# Altium schematic sheet 中继板子.SchDoc
size A3
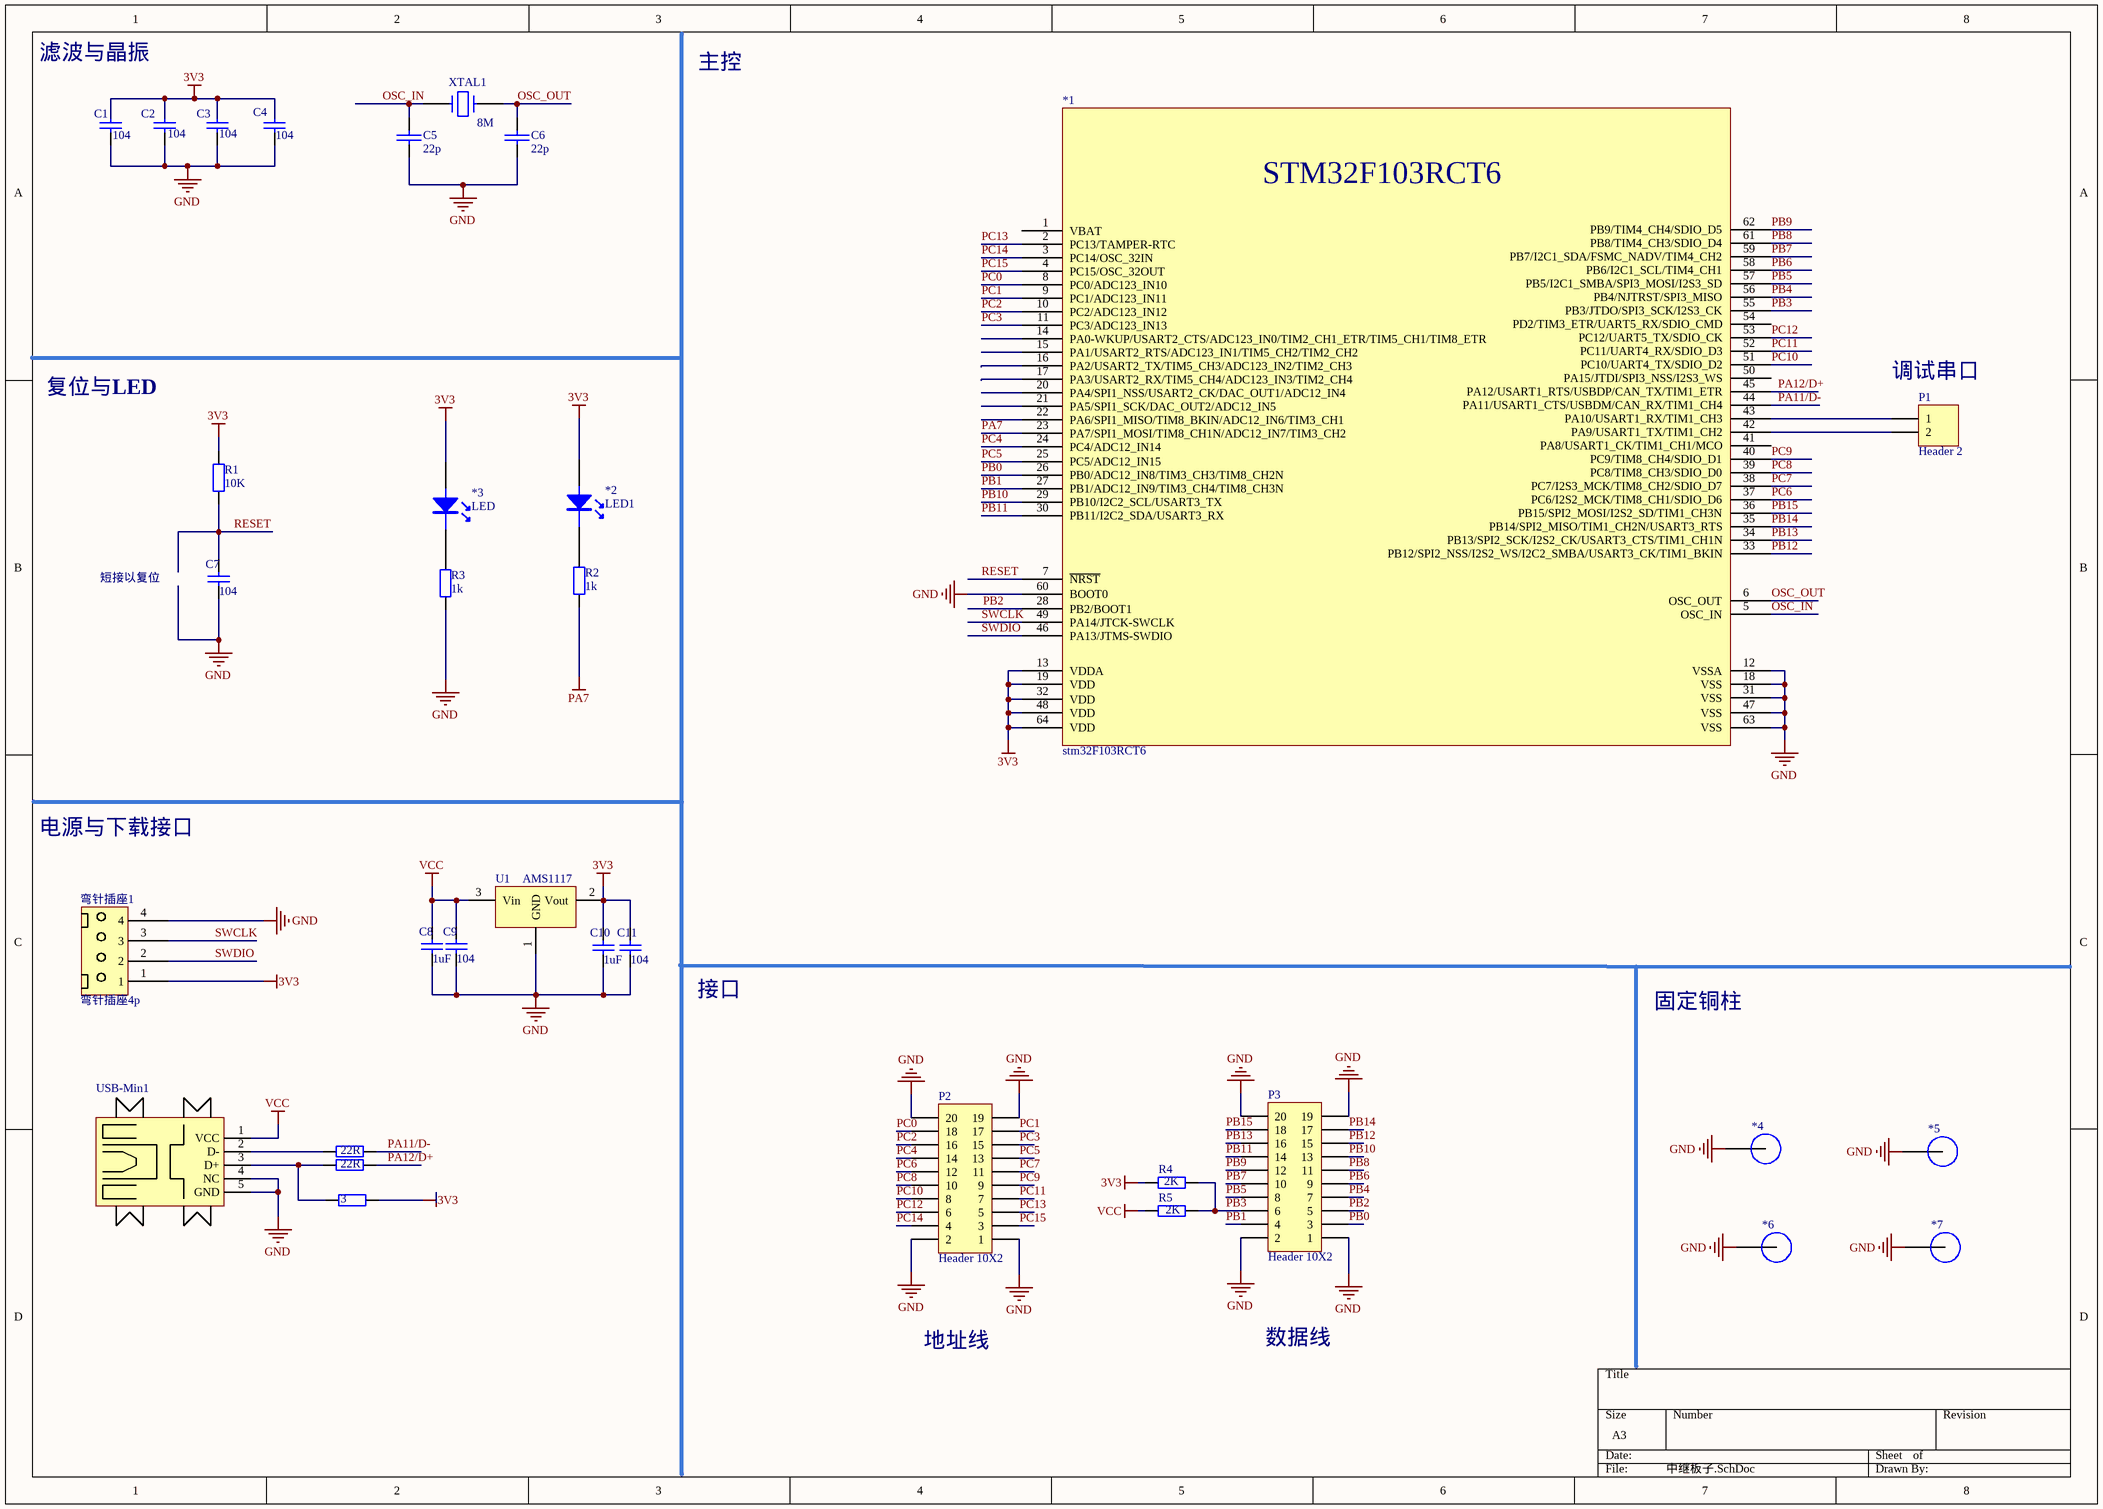
[diagram p0: 中继板子.SchDoc]

## Parts
1  22R  [R 0603]
2  22R  [R 0603]
3  Res  [R 0603]  (value not drawn)
*1  stm32F103RCT6  [LQF64]
*2  LED1  [LED 0805B]
*3  LED  [LED 0805B]
*4  定位孔  [定位孔]  (value not drawn)
*5  定位孔  [定位孔]  (value not drawn)
*6  定位孔  [定位孔]  (value not drawn)
*7  定位孔  [定位孔]  (value not drawn)
C1  104  [R 0603]
C2  104  [R 0603]
C3  104  [R 0603]
C4  104  [R 0603]
C5  22p  [R 0603]
C6  22p  [R 0603]
C7  value 104  [R 0603]  (hidden comment: Cap)
C8  value 1uF  [R 0603]  (hidden comment: Cap)
C9  value 104  [R 0603]  (hidden comment: Cap)
C10  value 1uF  [R 0603]  (hidden comment: Cap)
C11  value 104  [R 0603]  (hidden comment: Cap)
P1  Header 2  [HDR-1x2]
P2  Header 10X2  [HDR-10X2_H]
P3  Header 10X2  [HDR-10X2_H]
R1  value 10K  [R 0603]  (hidden comment: Res2)
R2  1k  [R 0603]
R3  1k  [R 0603]
R4  value 2K  [R 0603]  (hidden comment: Res2)
R5  value 2K  [R 0603]  (hidden comment: Res2)
U1  AMS1117  [AMS1117]
USB-Min1  USB-Mini  [USB-A/S_A]  (value not drawn)
XTAL1  8M  [XTAL-49S DIP]
弯针插座1  弯针插座4p  [XH2.54-4P]

## Nets
3V3: 3.1 *1.13(VDDA) *1.19(VDD) *1.32(VDD) *1.48(VDD) *1.64(VDD) *2.1 *3.1 C1.2 C2.2 C3.2 C4.2 C10.2 C11.2 R1.1 R4.2 U1.2(Vout) 弯针插座1.1
GND: *1.12(VSSA) *1.18(VSS) *1.31(VSS) *1.47(VSS) *1.60(BOOT0) *1.63(VSS) *4.1 *5.1 *6.1 *7.1 C1.1 C2.1 C3.1 C4.1 C5.2 C6.2 C7.1 C8.1 C9.1 C10.1 C11.1 P2.1 P2.2 P2.19 P2.20 P3.1 P3.2 P3.19 P3.20 R3.2 U1.1(GND) USB-Min1.4(NC) USB-Min1.5(GND) 弯针插座1.4
PA7: *1.23(PA7/SPI1_MOSI/TIM8_CH1N/ADC12_IN7/TIM3_CH2) R2.2
VCC: C8.2 C9.2 R5.2 U1.3(Vin) USB-Min1.1(VCC)
OSC_IN: *1.5(OSC_IN) C5.1 XTAL1.2
OSC_OUT: *1.6(OSC_OUT) C6.1 XTAL1.1
PA11/D-: 1.2 *1.44(PA11/USART1_CTS/USBDM/CAN_RX/TIM1_CH4)
PA12/D+: 2.2 *1.45(PA12/USART1_RTS/USBDP/CAN_TX/TIM1_ETR)
PB0: *1.26(PB0/ADC12_IN8/TIM3_CH3/TIM8_CH2N) P3.3
PB1: *1.27(PB1/ADC12_IN9/TIM3_CH4/TIM8_CH3N) P3.4
PB2: *1.28(PB2/BOOT1) P3.5
PB3: *1.55(PB3/JTDO/SPI3_SCK/I2S3_CK) P3.6 R4.1 R5.1
PB4: *1.56(PB4/NJTRST/SPI3_MISO) P3.7
PB5: *1.57(PB5/I2C1_SMBA/SPI3_MOSI/I2S3_SD) P3.8
PB6: *1.58(PB6/I2C1_SCL/TIM4_CH1) P3.9
PB7: *1.59(PB7/I2C1_SDA/FSMC_NADV/TIM4_CH2) P3.10
PB8: *1.61(PB8/TIM4_CH3/SDIO_D4) P3.11
PB9: *1.62(PB9/TIM4_CH4/SDIO_D5) P3.12
PB10: *1.29(PB10/I2C2_SCL/USART3_TX) P3.13
PB11: *1.30(PB11/I2C2_SDA/USART3_RX) P3.14
PB12: *1.33(PB12/SPI2_NSS/I2S2_WS/I2C2_SMBA/USART3_CK/TIM1_BKIN) P3.15
PB13: *1.34(PB13/SPI2_SCK/I2S2_CK/USART3_CTS/TIM1_CH1N) P3.16
PB14: *1.35(PB14/SPI2_MISO/TIM1_CH2N/USART3_RTS) P3.17
PB15: *1.36(PB15/SPI2_MOSI/I2S2_SD/TIM1_CH3N) P3.18
PC0: *1.8(PC0/ADC123_IN10) P2.18
PC1: *1.9(PC1/ADC123_IN11) P2.17
PC2: *1.10(PC2/ADC123_IN12) P2.16
PC3: *1.11(PC3/ADC123_IN13) P2.15
PC4: *1.24(PC4/ADC12_IN14) P2.14
PC5: *1.25(PC5/ADC12_IN15) P2.13
PC6: *1.37(PC6/I2S2_MCK/TIM8_CH1/SDIO_D6) P2.12
PC7: *1.38(PC7/I2S3_MCK/TIM8_CH2/SDIO_D7) P2.11
PC8: *1.39(PC8/TIM8_CH3/SDIO_D0) P2.10
PC9: *1.40(PC9/TIM8_CH4/SDIO_D1) P2.9
PC10: *1.51(PC10/UART4_TX/SDIO_D2) P2.8
PC11: *1.52(PC11/UART4_RX/SDIO_D3) P2.7
PC12: *1.53(PC12/UART5_TX/SDIO_CK) P2.6
PC13: *1.2(PC13/TAMPER-RTC) P2.5
PC14: *1.3(PC14/OSC_32IN) P2.4
PC15: *1.4(PC15/OSC_32OUT) P2.3
RESET: *1.7(~{NRST}) C7.2 R1.2
SWCLK: *1.49(PA14/JTCK-SWCLK) 弯针插座1.3
SWDIO: *1.46(PA13/JTMS-SWDIO) 弯针插座1.2
Net1_1: 1.1 USB-Min1.2(D-)
Net2_1: 2.1 3.2 USB-Min1.3(D+)
Net*1_42: *1.42(PA9/USART1_TX/TIM1_CH2) P1.2
Net*1_43: *1.43(PA10/USART1_RX/TIM1_CH3) P1.1
Net*2_2: *2.2 R2.1
Net*3_2: *3.2 R3.1

Not connected (* = marked no-connect by the designer): *1 1(VBAT) 14(PA0-WKUP/USART2_CTS/ADC123_IN0/TIM2_CH1_ETR/TIM5_CH1/TIM8_ETR) 15(PA1/USART2_RTS/ADC123_IN1/TIM5_CH2/TIM2_CH2) 16(PA2/USART2_TX/TIM5_CH3/ADC123_IN2/TIM2_CH3) 17(PA3/USART2_RX/TIM5_CH4/ADC123_IN3/TIM2_CH4) 20(PA4/SPI1_NSS/USART2_CK/DAC_OUT1/ADC12_IN4) 21(PA5/SPI1_SCK/DAC_OUT2/ADC12_IN5) 22(PA6/SPI1_MISO/TIM8_BKIN/ADC12_IN6/TIM3_CH1) 41(PA8/USART1_CK/TIM1_CH1/MCO) 50(PA15/JTDI/SPI3_NSS/I2S3_WS) 54(PD2/TIM3_ETR/UART5_RX/SDIO_CMD)

## Notes on the sheet
- (near C1) 滤波与晶振
- 主控
- (near P1) 调试串口
- 复位与LED
- 短接以复位
- 电源与下载接口
- 接口
- 固定铜柱
- 地址线
- 数据线
- (in symbol stm32F103RCT6) STM32F103RCT6

## Library data of the parts
1 2 R2 R3 = Res
*2 = LED
C1-C4 = Cap
C5 C6 = CAP
C7-C11 = Cap: Capacitor; Published: 8-Jun-2000; LatestRevisionDate: 17-Jul-2002; LatestRevisionNote: Re-released for DXP Platform.; PackageReference: RAD-0.3; Publisher: Altium Limited; PackageDescription: Radial Cap, Thru-Hole; 2 Leads; 0.3 in Pin Spacing
P1 = Header 2: Header, 2-Pin; LatestRevisionDate: 17-Jul-2002; LatestRevisionNote: Re-released for DXP Platform.; Publisher: Altium Limited
P2 P3 = Header 10X2: Header, 10-Pin, Dual row; LatestRevisionDate: 17-Jul-2002; LatestRevisionNote: Re-released for DXP Platform.; Publisher: Altium Limited
R1 R4 R5 = Res2: Resistor; Published: 8-Jun-2000; LatestRevisionDate: 17-Jul-2002; LatestRevisionNote: Re-released for DXP Platform.; PackageReference: AXIAL-0.4; Publisher: Altium Limited; PackageDescription: Axial Device, Thru-Hole; 2 Leads; 0.4 in Pin Spacing
U1 = AMS1117_1: 3.3V电压转换器AMS1117
XTAL1 = XTAL32